# EAGLE design PCBFAB (EAGLE 7.3.0)
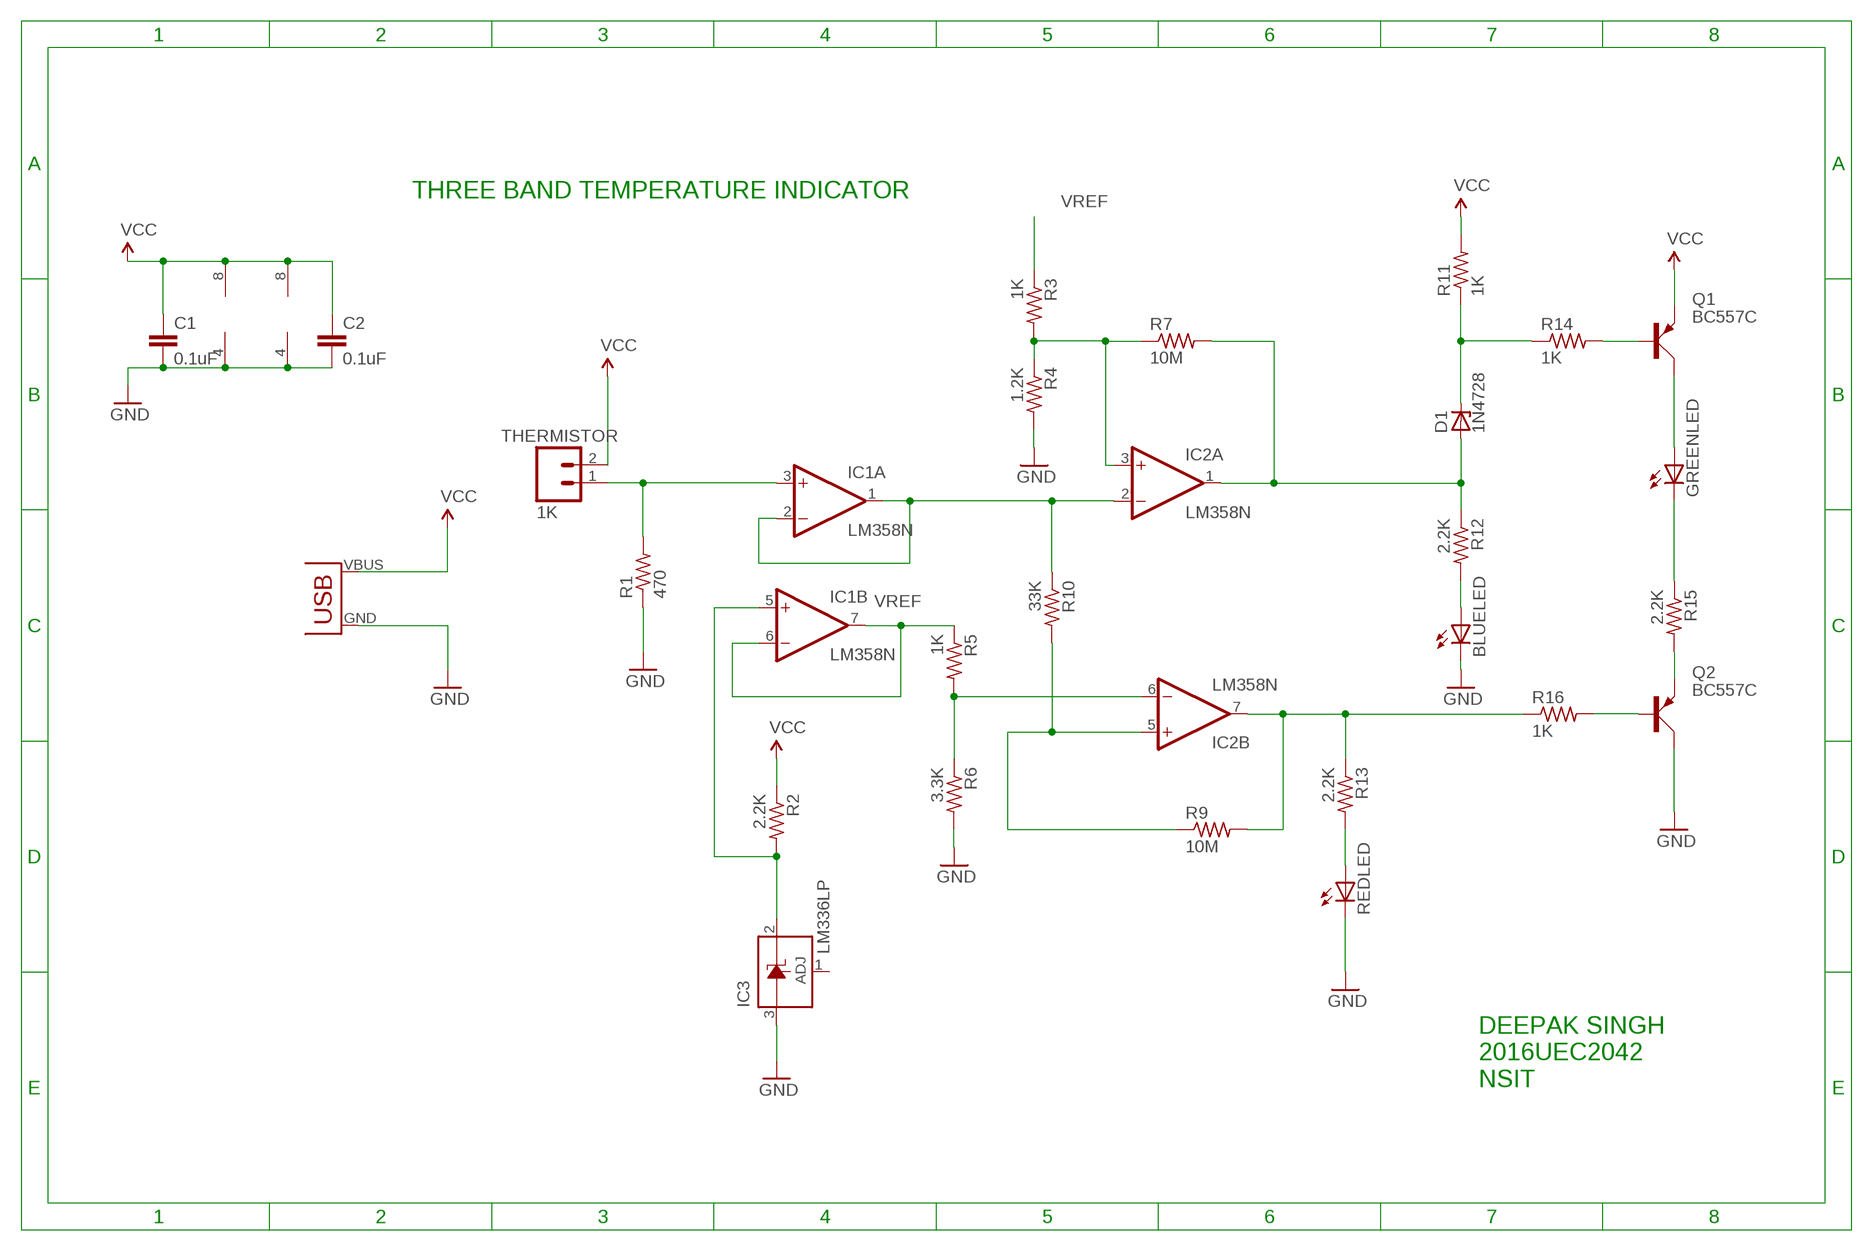
[diagram p0: schematic, sheet 1]

## Parts
BLUELED  LED5MM  [LED5MM]
C1  0.1uF  C-EU025-024X044  [C025-024X044]
C2  0.1uF  C-EU025-024X044  [C025-024X044]
D1  1N4728  [DO41Z10]
GREENLED  LED5MM  [LED5MM]
IC1  LM358N  [DIL08]
IC2  LM358N  [DIL08]
IC3  LM336LP  [TO92]
Q1  BC557C  BC557  [SOT54A]
Q2  BC557C  BC557  [SOT54A]
R1  470  R-US_0204/7  [0204/7]
R2  2.2K  R-US_0204/7  [0204/7]
R3  1K  R-US_0204/7  [0204/7]
R4  1.2K  R-US_0204/7  [0204/7]
R5  1K  R-US_0204/7  [0204/7]
R6  3.3K  R-US_0204/7  [0204/7]
R7  10M  R-US_0204/7  [0204/7]
R9  10M  R-US_0204/7  [0204/7]
R10  33K  R-US_0204/7  [0204/7]
R11  1K  R-US_0204/7  [0204/7]
R12  2.2K  R-US_0204/7  [0204/7]
R13  2.2K  R-US_0204/7  [0204/7]
R14  1K  R-US_0204/7  [0204/7]
R15  2.2K  R-US_0204/7  [0204/7]
R16  1K  R-US_0204/7  [0204/7]
REDLED  LED5MM  [LED5MM]
THERMISTOR  1K  M02  [02P]
U$1  USB(POWER)  [USB(POWER)]

## Nets
D: IC1.1(A:OUT) IC1.2(A:-IN) IC2.2(A:-IN) R10.1
GND: BLUELED.K(C) C1.2 C2.2 IC1.4(P:V-) IC2.4(P:V-) IC3.3(A) Q2.C R1.1 R4.2 R6.2 REDLED.K(C) U$1.GND
N$1: IC2.3(A:+IN) R3.2 R4.1 R7.1
N$2: IC2.5(B:+IN) R9.1 R10.2
N$3: IC1.5(B:+IN) IC3.2(C) R2.2
N$4: IC1.3(A:+IN) R1.2 THERMISTOR.1
N$5: IC2.6(B:-IN) R5.2 R6.1
N$6: D1.A IC2.1(A:OUT) R7.2 R12.1
N$7: IC2.7(B:OUT) R9.2 R13.1 R16.1
N$8: Q1.B R14.2
N$10: R13.2 REDLED.A
N$11: BLUELED.A R12.2
N$12: D1.C R11.1 R14.1
N$14: Q2.B R16.2
N$15: GREENLED.A Q1.C
N$16: GREENLED.K(C) R15.1
N$17: Q2.E R15.2
VCC: C1.1 C2.1 IC1.8(P:V+) IC2.8(P:V+) Q1.E R2.1 R11.2 THERMISTOR.2 U$1.VBUS(VCC)
VREF: IC1.6(B:-IN) IC1.7(B:OUT) R3.1 R5.1
Unconnected: IC3.1(ADJ)

## Notes on the sheet
- THREE BAND TEMPERATURE INDICATOR
- DEEPAK SINGH
  2016UEC2042
  NSIT

## Library data of the parts
BLUELED GREENLED REDLED = CEDT_JANUARY_2015_v7:LED
C1 C2 = rcl:C-EU: CAPACITOR, European symbol
D1 = diode:1N4728: Z DIODE 3.3 V, 1W, 5 percent
IC1 IC2 = CEDT_JANUARY_2015_v7:LM358: OP AMP also LM158; LM258; LM2904 Source: http://cache.national.com/ds/LM/LM158.pdf
IC3 = linear:LM336: 2.5-V INTEGRATED REFERENCE CIRCUITS LM236 Source: http://focus.ti.com/lit/ds/symlink/lm336-2.5.pdf
Q1 Q2 = transistor-small-signal:BC557: PNP TRANSISTOR
R1-R7 R9-R16 = SUBTRACTORdeepak:R-US_: RESISTOR, American symbol
THERMISTOR = SUBTRACTORdeepak:M02: AMP QUICK CONNECTOR
U$1 = CEDT_JANUARY_2015_v7:USB(POWER)

## Board
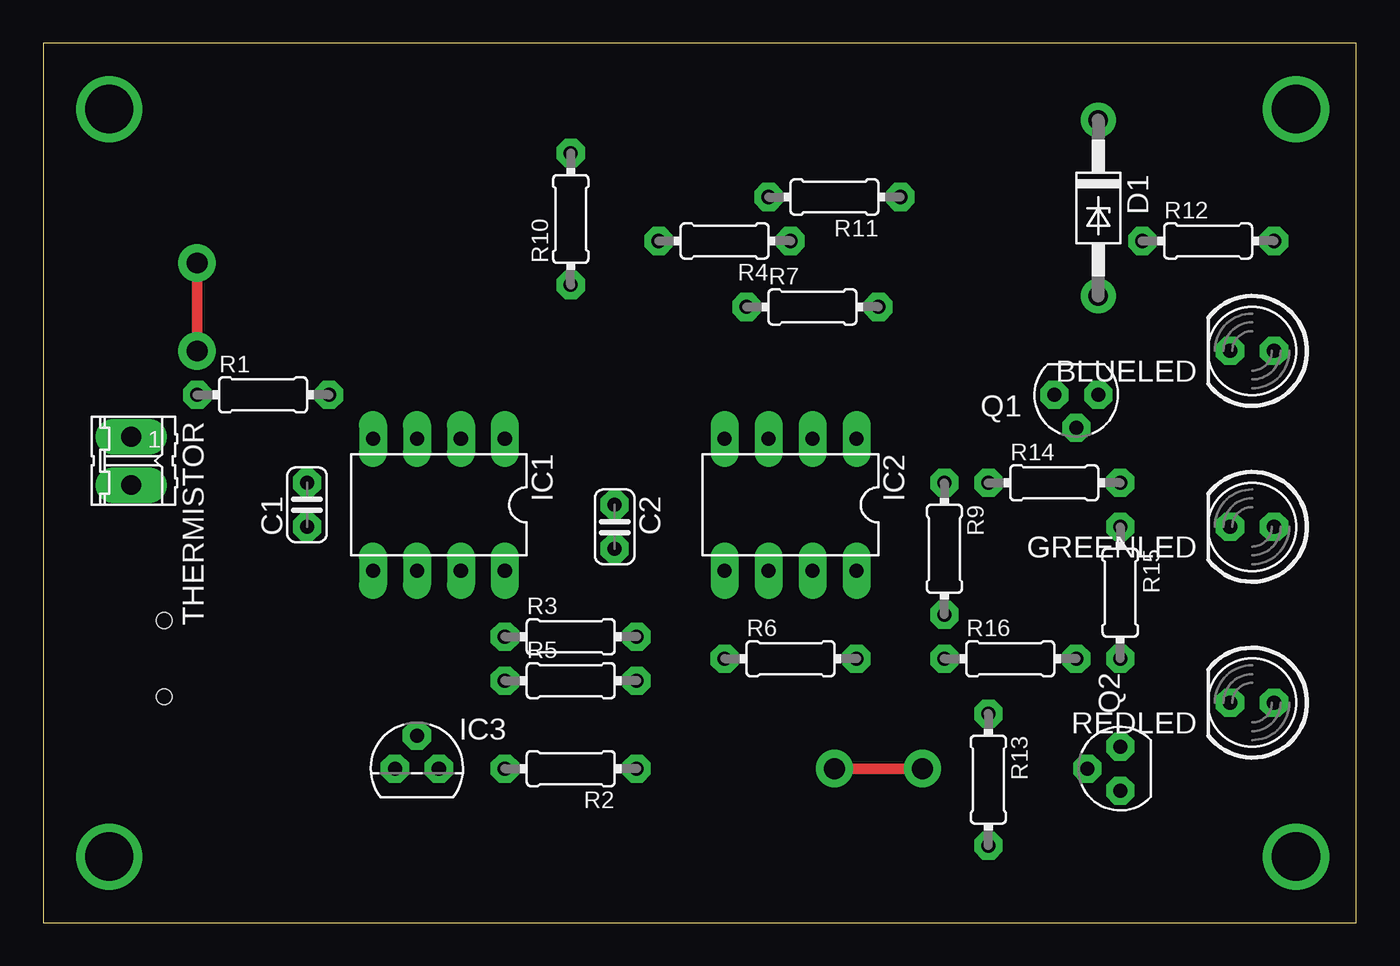
[diagram p1: board, top side]
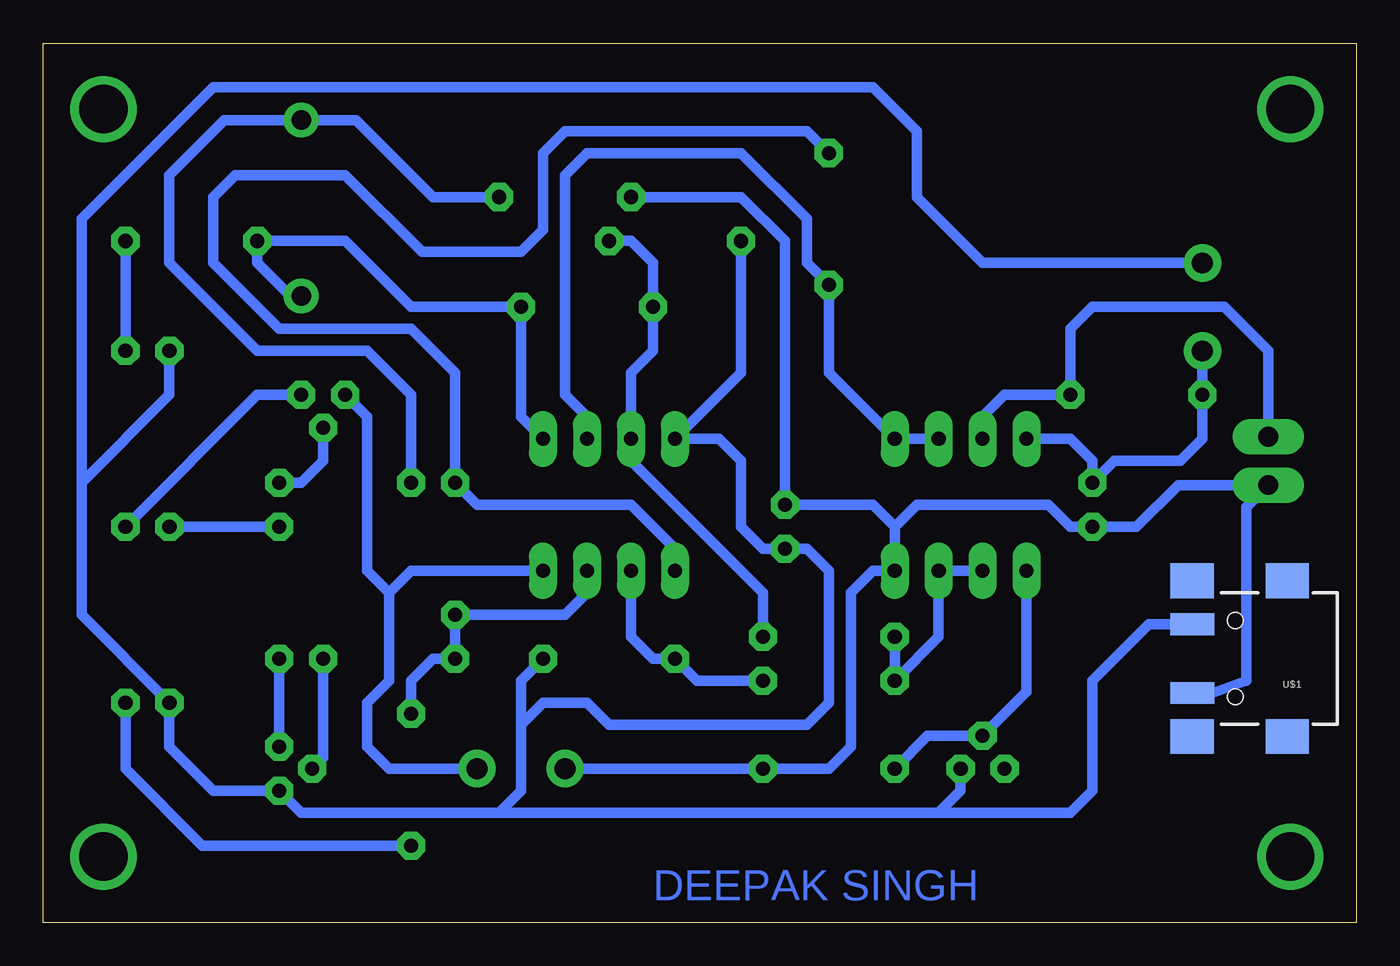
[diagram p2: board, bottom side, seen from below]

Size 75.87 x 50.79 mm. Coordinates in mm from the lower left corner, seen from the top.
Outline: 0,0 75.87,0 75.87,50.79 0,50.79 0,0
Copper layers (1*16): Top 0.035mm / dielectric 1.5mm / Bottom 0.035mm
Design rules "default *": minimum track width 10mil, minimum drill 24mil, track to track 16mil, track to pad 16mil, pad to pad 16mil, via to via 16mil, smd to smd 8mil, copper to edge 40mil, drill to drill 8mil, minimum pad ring 16mil, minimum via ring 16mil, stop-mask expansion 4mil, vias tented up to drill 0mil, thermal gap 10mil

### Footprints (pad centres in the part's own frame; a part is rotated, then mirrored left to right if it is on the bottom)
LED5MM = drill 0.813 octagon: A -1.27,0; K 1.27,0
C025-024X044 = drill 0.813 octagon: 1 -1.27,0; 2 1.27,0
DO41Z10 = drill 1.118: A 5.08,0; C -5.08,0
DIL08 = drill 0.813 long: 1 -3.81,-3.81; 2 -1.27,-3.81; 3 1.27,-3.81; 4 3.81,-3.81; 5 3.81,3.81; 6 1.27,3.81; 7 -1.27,3.81; 8 -3.81,3.81
TO92 = drill 0.813 octagon: 1 -1.27,0; 2 0,1.905; 3 1.27,0
SOT54A = drill 0.813 octagon: B 0,1.905; C -1.27,0; E 1.27,0
0204/7 = drill 0.813 octagon: 1 -3.81,0; 2 3.81,0
02P = drill 1.143 long: 1 -1.397,0; 2 1.397,0
USB(POWER) = smd 2.54 x 1.27: GND 2.5,-1.981; VBUS 2.5,1.981 | smd 2.5 x 2: GND@1 -3,-4.5; GND@2 -3,4.5; GND@3 2.5,4.5; GND@4 2.5,-4.5 | hole 0.9: 0,2.2; 0,-2.2

### Placement (x,y rotation side)
BLUELED  69.85,33.02 180 top
C1  15.24,24.13 90 top
C2  33.02,22.86 270 top
D1  60.96,41.27 270 top
GREENLED  69.85,22.86 180 top
IC1  22.86,24.13 180 top
IC2  43.18,24.13 180 top
IC3  21.59,8.89 0 top
Q1  59.69,30.48 180 top
Q2  62.23,8.89 90 top
R1  12.7,30.48 0 top
R2  30.48,8.89 180 top
R3  30.48,16.51 0 top
R4  39.37,39.37 180 top
R5  30.48,13.97 0 top
R6  43.18,15.24 0 top
R7  44.45,35.56 0 top
R9  52.07,21.59 270 top
R10  30.48,40.64 90 top
R11  45.72,41.91 180 top
R12  67.31,39.37 0 top
R13  54.61,8.26 270 top
R14  58.42,25.4 0 top
R15  62.23,19.05 270 top
R16  55.88,15.24 0 top
REDLED  69.85,12.7 180 top
THERMISTOR  5.08,26.67 270 top
U$1  6.99,15.24 180 bottom

### Tracks (layer width: path | path; a pad name or v marks a point on that pad's centre or on a via)
D
  Bottom 0.61: IC1.2 IC1.1 30.48,31.75 R10.1 31.75,38.1 31.75,40.64 35.56,44.45 44.45,44.45 45.72,43.18 45.72,30.48 44.45,29.21 IC2.2
GND  (via drill 1.2 pad 1.93)
  Top 0.61: v8.89,38.1 v8.89,33.02
  Bottom 0.61: IC1.4 16.51,27.94 15.24,26.67 C1.2 13.97,26.67 10.16,26.67 8.89,27.94 R1.1 v8.89,33.02 | U$1.GND 11.99,17.22 15.24,13.97 15.24,7.62 16.51,6.35 24.13,6.35 | R4.2 35.56,31.75 IC2.4 36.83,27.94 35.56,26.67 35.56,22.86 34.29,21.59 C2.2 31.75,21.59 30.48,20.32 30.48,12.7 31.75,11.43 43.18,11.43 44.45,12.7 46.99,12.7 48.26,11.43 | 24.13,6.35 49.53,6.35 | 49.53,6.35 60.96,6.35 Q2.C 66.04,7.62 68.58,10.16 REDLED.K 73.66,17.78 73.66,25.4 | IC3.3 22.86,7.62 24.13,6.35 | 49.53,6.35 48.26,7.62 48.26,11.43 | BLUELED.K 68.58,30.48 73.66,25.4 | v8.89,38.1 21.59,38.1 25.4,41.91 25.4,45.72 27.94,48.26 66.04,48.26 73.66,40.64 73.66,25.4 | 48.26,11.43 48.26,13.97 R6.2
N$1
  Bottom 0.61: R4.1 41.91,39.37 40.64,38.1 R7.1 40.64,33.02 41.91,31.75 IC2.3 41.91,26.67 34.29,19.05 R3.2
N$2
  Bottom 0.61: IC2.5 39.37,21.59 41.91,24.13 50.8,24.13 R9.1 52.07,31.75 54.61,34.29 62.23,34.29 66.04,38.1 66.04,41.91 64.77,43.18 58.42,43.18 53.98,38.73 48.26,38.73 46.99,40.01 46.99,44.45 45.72,45.72 31.75,45.72 R10.2
N$3
  Bottom 0.61: R2.2 24.77,10.79 IC3.2 19.05,13.34 IC1.5
N$4
  Bottom 0.61: IC1.3 21.59,29.21 20.32,30.48 R1.2 16.51,34.29 15.24,35.56 7.62,35.56 5.08,33.02 THERMISTOR.1
N$5
  Bottom 0.61: 41.91,19.05 IC2.6 41.91,16.51 40.64,15.24 R6.1 38.1,13.97 R5.2
N$6
  Bottom 0.61: IC2.1 48.26,29.21 R7.2 54.61,35.56 58.42,39.37 R12.1 63.5,38.1 61.59,36.2 D1.A
N$7
  Bottom 0.61: IC2.7 44.45,19.05 45.72,17.78 R9.2 R16.1 53.34,15.24 54.61,13.97 R13.1
N$8
  Bottom 0.61: R14.2 60.96,25.4 59.69,26.67 Q1.B
N$9  (via drill 2.8 pad 3.81)
  other vias: 72.39,46.99
N$10
  Bottom 0.61: R13.2 66.67,4.45 71.12,8.89 REDLED.A
N$11
  Bottom 0.61: BLUELED.A R12.2
N$12
  Bottom 0.61: R14.1 54.61,30.48 57.15,33.02 63.5,33.02 68.58,38.1 68.58,43.18 65.41,46.35 D1.C 57.78,46.35 53.34,41.91 R11.1
N$13  (via drill 2.8 pad 3.81)
  other vias: 3.81,46.99
N$14
  Bottom 0.61: R16.2 59.69,9.53 Q2.B
N$15
  Bottom 0.61: Q1.C 63.5,30.48 GREENLED.A
N$16
  Bottom 0.61: R15.1 GREENLED.K
N$17
  Bottom 0.61: R15.2 Q2.E
N$18  (via drill 2.8 pad 3.81)
  other vias: 3.81,3.81
N$19  (via drill 2.8 pad 3.81)
  other vias: 72.39,3.81
VCC  (via drill 1.2 pad 1.93)
  Top 0.61: v45.72,8.89 v50.8,8.89
  Bottom 0.61: 50.8,20.32 IC2.8 54.61,20.32 55.88,19.05 | R11.2 35.56,41.91 33.02,39.37 C2.1 27.94,24.13 26.67,22.86 | 26.67,22.86 IC1.8 27.94,20.32 29.21,19.05 29.21,10.16 30.48,8.89 R2.1 v45.72,8.89 | 26.67,22.86 25.4,24.13 17.78,24.13 16.51,22.86 C1.1 12.7,22.86 10.29,25.27 THERMISTOR.2 6.35,24 6.35,13.97 8.33,13.26 U$1.VBUS | 55.88,19.05 55.88,13.97 57.15,12.7 57.15,10.16 55.88,8.89 v50.8,8.89 | Q1.E 57.15,29.21 57.15,20.32 55.88,19.05
VREF
  Bottom 0.61: IC1.6 IC1.7 24.13,16.51 R5.1 R3.1

### Text on the board
Bottom: DEEPAK SINGH